# Altium schematic sheet 1.XBEE Interface.SchDoc
size A4
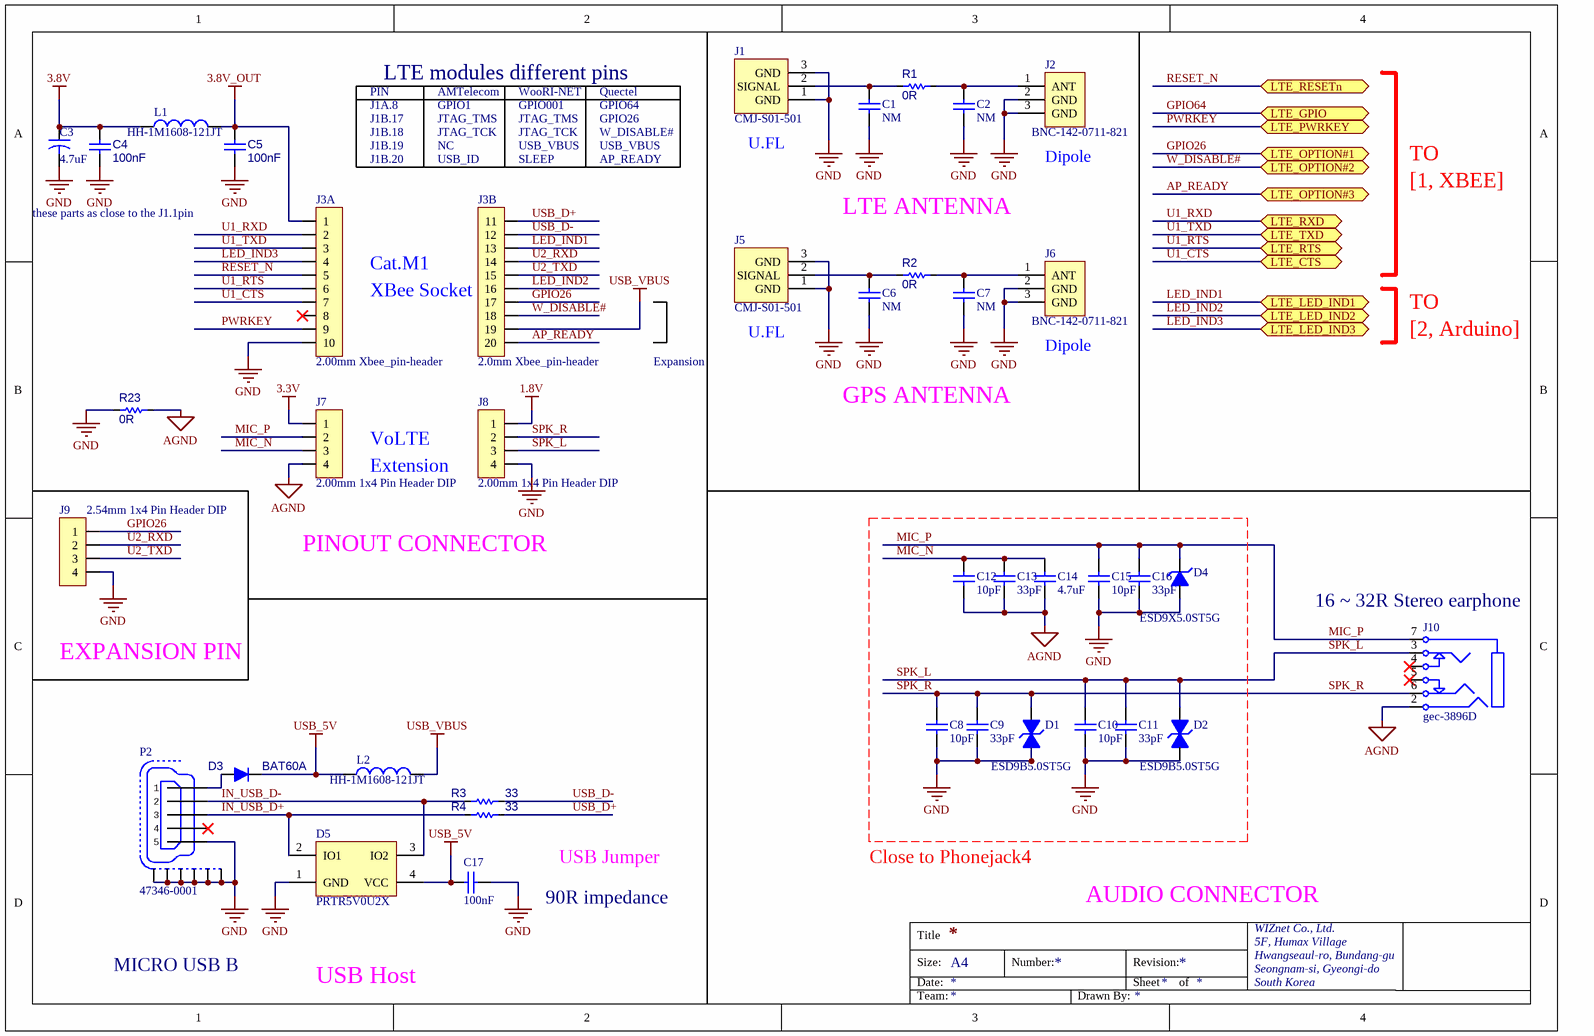
[diagram p0: 1.XBEE Interface.SchDoc]

## Parts
C1  NM  [CAP-0402]
C2  NM  [CAP-0402]
C3  4.7uF  [CAP-A Size]
C4  100nF  [CAP-0603]
C5  100nF  [CAP-0603]
C6  NM  [CAP-0402]
C7  NM  [CAP-0402]
C8  10pF  [CAP-0402]
C9  33pF  [CAP-0402]
C10  10pF  [CAP-0402]
C11  33pF  [CAP-0402]
C12  10pF  [CAP-0402]
C13  33pF  [CAP-0402]
C14  4.7uF  [CAP-0603]
C15  10pF  [CAP-0402]
C16  33pF  [CAP-0402]
C17  100nF  [CAP-0402]
D1  ESD9B5.0ST5G  [SOD-882(TVS)]
D2  ESD9B5.0ST5G  [SOD-882(TVS)]
D3  BAT60A  [SOD-323(1-C,2-A)]
D4  ESD9X5.0ST5G  [SOD-923(1-C,2-A)]
D5  PRTR5V0U2X  [SOT-143]
J1  CMJ-S01-501  [BNC-CMJ-S01-501]
J2  BNC-142-0711-821  [BNC-142-0711-821]
J3  2.00mm Xbee_pin-header  [XBEE(1)]  (parts A,B of 2)
J5  CMJ-S01-501  [BNC-CMJ-S01-501]
J6  BNC-142-0711-821  [BNC-142-0711-821]
J7  2.00mm 1x4 Pin Header DIP  [IDC-1X4(2MM)]
J8  2.00mm 1x4 Pin Header DIP  [IDC-1X4(2MM)]
J9  2.54mm 1x4 Pin Header DIP  [IDC-1X4]
J10  gec-3896D  [PJ-3.5-3106]
L1  HH-1M1608-121JT  [IND-0603]
L2  HH-1M1608-121JT  [IND-0603]
P2  47346-0001  [USB-MOLEX-47346]
R1  0R  [RES-0402]
R2  0R  [RES-0402]
R3  33  [RES-0603]
R4  33  [RES-0603]
R23  0R  [RES-0603]

## Ports
LTE_CTS, LTE_GPIO, LTE_LED_IND1, LTE_LED_IND2, LTE_LED_IND3, LTE_OPTION#1, LTE_OPTION#2, LTE_OPTION#3, LTE_PWRKEY, LTE_RESETn, LTE_RTS, LTE_RXD, LTE_TXD

## Nets
1.8V: J8.1
3.3V: J7.1
3.8V: C3.1 C4.1 L1.1
3.8V_OUT: C5.1 J3.1 L1.2
AGND: C12.1 C13.1 C14.1 J7.4 J10.2 R23.2
GND: C1.1 C2.1 C3.2 C4.2 C5.2 C6.1 C7.1 C8.1 C9.1 C10.1 C11.1 C15.1 C16.1 C17.2 D1.2 D2.2 D4.2 D5.1(GND) J1.1(GND) J1.3(GND) J2.2(GND) J2.3(GND) J3.10 J5.1(GND) J5.3(GND) J6.2(GND) J6.3(GND) J8.4 J9.4 P2.5 P2.6 P2.7 P2.8 P2.9 P2.10 P2.11 R23.1
USB_5V: C17.1 D3.1(K) D5.4(VCC) L2.1
USB_VBUS: J3.19 L2.2
AP_READY: J3.20 ; port LTE_OPTION#3
GPIO26: J3.17 J9.1 ; port LTE_OPTION#1
GPIO64: port LTE_GPIO
IN_USB_D+: D5.2(IO1) P2.3 R4.2
IN_USB_D-: D5.3(IO2) P2.2 R3.2
LED_IND1: J3.13 ; port LTE_LED_IND1
LED_IND2: J3.16 ; port LTE_LED_IND2
LED_IND3: J3.4 ; port LTE_LED_IND3
MIC_N: C12.2 C13.2 C14.2 J7.3
MIC_P: C15.2 C16.2 D4.1 J7.2 J10.7
PWRKEY: J3.9 ; port LTE_PWRKEY
RESET_N: J3.5 ; port LTE_RESETn
SPK_L: C10.2 C11.2 D2.1 J8.3 J10.3
SPK_R: C8.2 C9.2 D1.1 J8.2 J10.6
U1_CTS: J3.7 ; port LTE_CTS
U1_RTS: J3.6 ; port LTE_RTS
U1_RXD: J3.2 ; port LTE_RXD
U1_TXD: J3.3 ; port LTE_TXD
U2_RXD: J3.14 J9.2
U2_TXD: J3.15 J9.3
USB_D+: J3.11 R4.1
USB_D-: J3.12 R3.1
W_DISABLE#: J3.18 ; port LTE_OPTION#2
NetC1_2: C1.2 J1.2(SIGNAL) R1.1
NetC2_2: C2.2 J2.1(ANT) R1.2
NetC6_2: C6.2 J5.2(SIGNAL) R2.1
NetC7_2: C7.2 J6.1(ANT) R2.2
NetD3_2: D3.2(A) P2.1

Not connected (* = marked no-connect by the designer): J3 8*; J10 4* 5*; P2 4*

## Notes on the sheet
- J1A.8
- PIN
- LTE modules different pins
- AMTelecom
- GPIO1
- WooRI-NET
- GPIO001
- Quectel
- GPIO64
- J1B.17
- J1B.18
- J1B.19
- J1B.20
- USB_ID
- NC
- JTAG_TMS
- JTAG_TCK
- SLEEP
- USB_VBUS
- GPIO26
- W_DISABLE#
- AP_READY
- (near J1) U.FL
- (near J2) Dipole
- TO
- these parts as close to the J1.1pin
- LTE ANTENNA
- [1, XBEE]
- (near J3) XBee Socket
- Cat.M1
- Expansion
- (near J5) U.FL
- (near J6) Dipole
- [2, Arduino]
- VoLTE
- GPS ANTENNA
- Extension
- PINOUT CONNECTOR
- (near J10) 16 ~ 32R Stereo earphone
- EXPANSION PIN
- 90R impedance
- USB Jumper
- Close to Phonejack4
- AUDIO CONNECTOR
- MICRO USB B
- USB Host
- Title
- Size:
- Date:
- A4
- Number:
- Revision:
- Sheet
- of
- WIZnet Co., Ltd.
- 5F, Humax Village
- Hwangseaul-ro, Bundang-gu
- Seongnam-si, Gyeongi-do
- South Korea
- Team:
- Drawn By:

## Library data of the parts
C1 C2 C6-C13 C15 C16 = CAP-0402: Ceramic CAP 0402(1005)
C3 = CAP: Electrolytic Capacitors
C4 C5 C14 = CAP-0603: Ceramic CAP 0603(1608)
C17 = CAP-0805: Ceramic CAP 0402
D1 D2 = PESD5V0S1BL: Bi-directional TVS diode
D3 = DIODE-BAT60A: Silicon Schottky Diode
D4 = ESD9X5.0ST5G: Uni-directional TVS diode
D5 = PRTR5V0U2X: Ultra low capacitance double rail-to-rail ESD protection diode; Manufacturer: NXP; 2nd source part number: 152-4157; Artikkelnr Noca: 10069015; Artikkelnr Simpro: N.A.; Part Number: PRTR5V0U2X; Manufacturer Part Number: PRTR5V0U2X; Datasheet: http://www.farnell.com/datasheets/109718.pdf; LatestRevisionDate: 2012-06-11; Publisher: Nordic Semiconductor; Published: 2012-06-11; Value: PRTR5V0U2X; Note: *; Supplier: Digi-Key; Supplier part number: 568-4140-1-ND; 2nd source Supplier: Farnell; Footprint Doc: SOT-143B
J1 J5 = U.FL CONNECTOR
J2 J6 = SMA_Female
J3 = Xbee_pin-header: Xbee_pin-header, WizFi310, LoRa, LTE CAT M1
J10 = Phonejack 6: 3-Conductor Jack with 2 break contacts (normals) and 2 auxiliary make contacts; Published: 5-Jan-2004; LatestRevisionDate: 17-Dec-2003; LatestRevisionNote: PCB Footprint replaced.; DatasheetDocument: 07-Mar-2000; Publisher: Altium Limited; ComponentLink1Description: Manufacturer Link; ComponentLink1URL: http://domino.kycon.com/internet/Products.html
L1 L2 = IND-0603: Inductor 0603(1608)
P2 = 47346-0001: MICRO USB B Type
R1 R2 = RES-0402
R3 R4 R23 = RES-0603: RES0603